# Altium schematic sheet PowerSide.SchDoc
size A4
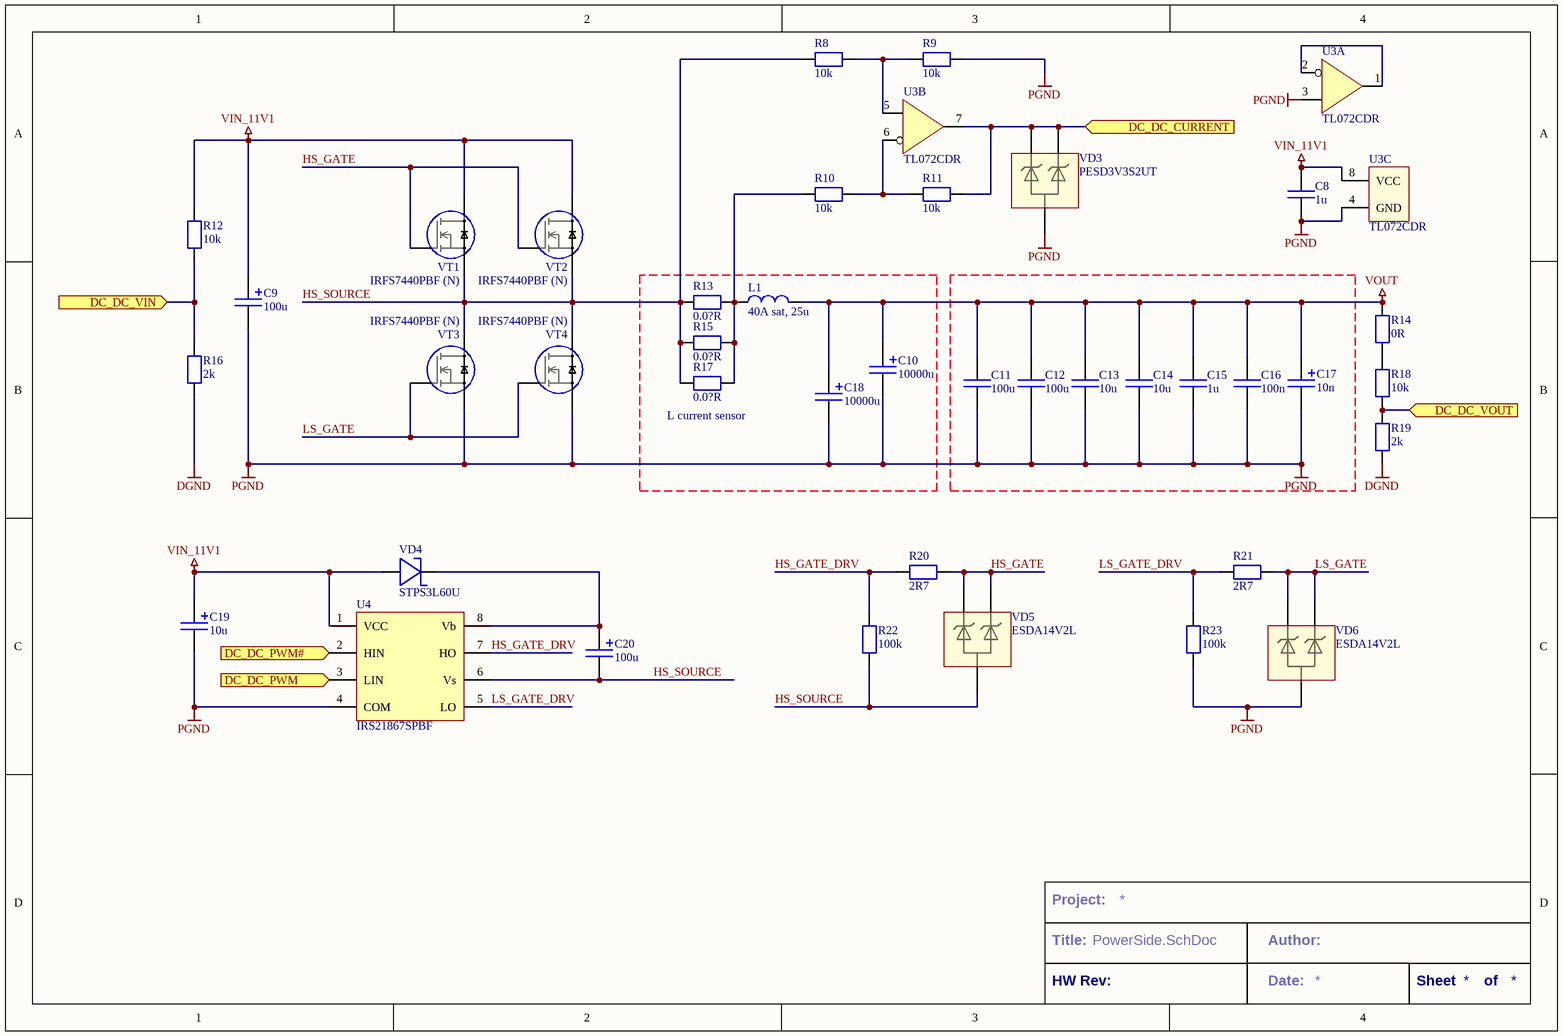
[diagram p0: PowerSide.SchDoc]

## Parts
C8  1u  [C_0805/2012]
C9  100u  [TECAP_TYPE_D]
C10  10000u  [C_ELECTROLYTIC_6x35]
C11  100u  [C_1206/3216]
C12  100u  [C_1206/3216]
C13  10u  [C_1206/3216]
C14  10u  [C_1206/3216]
C15  1u  [C_1206/3216]
C16  100n  [C_1206/3216]
C17  10n  [TECAP_TYPE_D]
C18  10000u  [C_ELECTROLYTIC_6x35]
C19  10u  [TECAP_TYPE_D]
C20  100u  [TECAP_TYPE_D]
L1  40A sat, 25u  [L_30x20x10 _SMD]
R8  10k  [R_0603/1608]
R9  10k  [R_0603/1608]
R10  10k  [R_0402/1005]
R11  10k  [R_0402/1005]
R12  10k  [R_0402/1005]
R13  0.0?R  [R_2512/6332]
R14  0R  [R_0603/1608]
R15  0.0?R  [R_2512/6332]
R16  2k  [R_0402/1005]
R17  0.0?R  [R_2512/6332]
R18  10k  [R_0603/1608]
R19  2k  [R_0603/1608]
R20  2R7  [R_1206/3216]
R21  2R7  [R_1206/3216]
R22  100k  [R_0805/2012]
R23  100k  [R_0805/2012]
U3  TL072CDR  [SO8_1.27]  (parts A,B,C of 3)
U4  IRS21867SPBF  [SO8_1.27]
VD3  PESD3V3S2UT  [SOT23-3]
VD4  STPS3L60U  [DO214AA/SMB]
VD5  ESDA14V2L  [SOT23-3]
VD6  ESDA14V2L  [SOT23-3]
VT1  IRFS7440PBF (N)  [TO263-2/D2PAK-2]
VT2  IRFS7440PBF (N)  [TO263-2/D2PAK-2]
VT3  IRFS7440PBF (N)  [TO263-2/D2PAK-2]
VT4  IRFS7440PBF (N)  [TO263-2/D2PAK-2]

## Blocks framed on the sheet
L current sensor: C10 C18 L1 R13 R15 R17

## Ports
DC_DC_CURRENT, DC_DC_PWM, DC_DC_PWM#, DC_DC_VIN, DC_DC_VOUT

## Nets
DGND: R16.1 R19.1
PGND: C8.1 C9.2(NEG) C10.2(NEG) C11.1 C12.1 C13.1 C14.1 C15.1 C16.1 C17.2(NEG) C18.2(NEG) C19.2(NEG) R9.1 R23.2 U3.3 U3.4(GND) U4.4(COM) VD3.A VD6.A VT3.S VT4.S
VIN_11V1: C8.2 C9.1(POS) C19.1(POS) R12.2 U3.8(VCC) U4.1(VCC) VD4.A VT1.D VT2.D
VOUT: C10.1(POS) C11.2 C12.2 C13.2 C14.2 C15.2 C16.2 C17.1(POS) C18.1(POS) L1.2 R14.2
DC_DC_CURRENT: R11.1 U3.7(OUT) VD3.1C VD3.2C ; port DC_DC_CURRENT
DC_DC_PWM: U4.3(LIN) ; port DC_DC_PWM
DC_DC_PWM#: U4.2(HIN) ; port DC_DC_PWM#
DC_DC_VIN: R12.1 R16.2 ; port DC_DC_VIN
DC_DC_VOUT: R18.1 R19.2 ; port DC_DC_VOUT
HS_GATE: R20.2 VD5.1C VD5.2C VT1.G VT2.G
HS_GATE_DRV: R20.1 R22.1 U4.7(HO)
HS_SOURCE: C20.2(NEG) R8.2 R13.2 R15.2 R17.2 R22.2 U4.6(Vs) VD5.A VT1.S VT2.S VT3.D VT4.D
LS_GATE: R21.2 VD6.1C VD6.2C VT3.G VT4.G
LS_GATE_DRV: R21.1 R23.1 U4.5(LO)
NetC20_1: C20.1(POS) U4.8(Vb) VD4.C(C`)
NetL1_1: L1.1 R10.2 R13.1 R15.1 R17.1
NetR8_1: R8.1 R9.2 U3.5
NetR10_1: R10.1 R11.2 U3.6
NetR14_1: R14.1 R18.2
NetU3_1: U3.1(OUT) U3.2

## Notes on the sheet
- Project:
- Title:
- HW Rev:
- Author:
- Date:
- Sheet
- of

## Library data of the parts
C8 C11-C16 = Capacitor: Non-polarized capacitor
C9 C10 C17-C20 = Capacitor polar: Polarized capacitor
L1 = Inductor: pin to pad: 1>2 2>1
R8-R23 = Resistor
U3 = Op-amp dual: Dual operation amplifier
U4 = IRS21867SPBF: MOSFET driver
VD3 VD5 VD6 = TVS x2 A-COM: TVS x2; pin to pad: 1C>1 2C>2 A>3
VD4 = Schottky: Schottky diode; pin to pad: A>2 C>1
VT1-VT4 = MOSFET N: pin to pad: D>3 G>1 S>2